# Altium schematic sheet Sheet1ofNumberHatExpansionAndAnalogForPi5.SchDoc
size A3; SheetNumber: 1; SheetTotal: 2
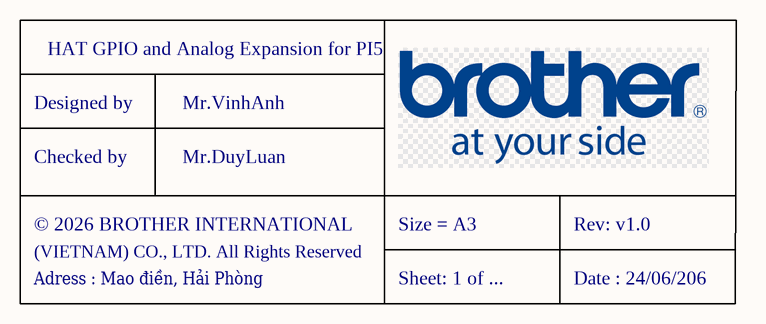
[diagram p0: Sheet1ofNumberHatExpansionAndAnalogForPi5.SchDoc]

## Notes on the sheet
- HAT GPIO and Analog Expansion for PI5
- Designed by
- Mr.VinhAnh
- Checked by
- Mr.DuyLuan
- © 2026 BROTHER INTERNATIONAL
- (VIETNAM) CO., LTD. All Rights Reserved
- Adress : Mao điền, Hải Phòng
- Size = A3
- Sheet: 1 of ...
- Rev: v1.0
- Date : 24/06/206